# Altium schematic sheet WX0.007.102DL.SchDoc
size A3
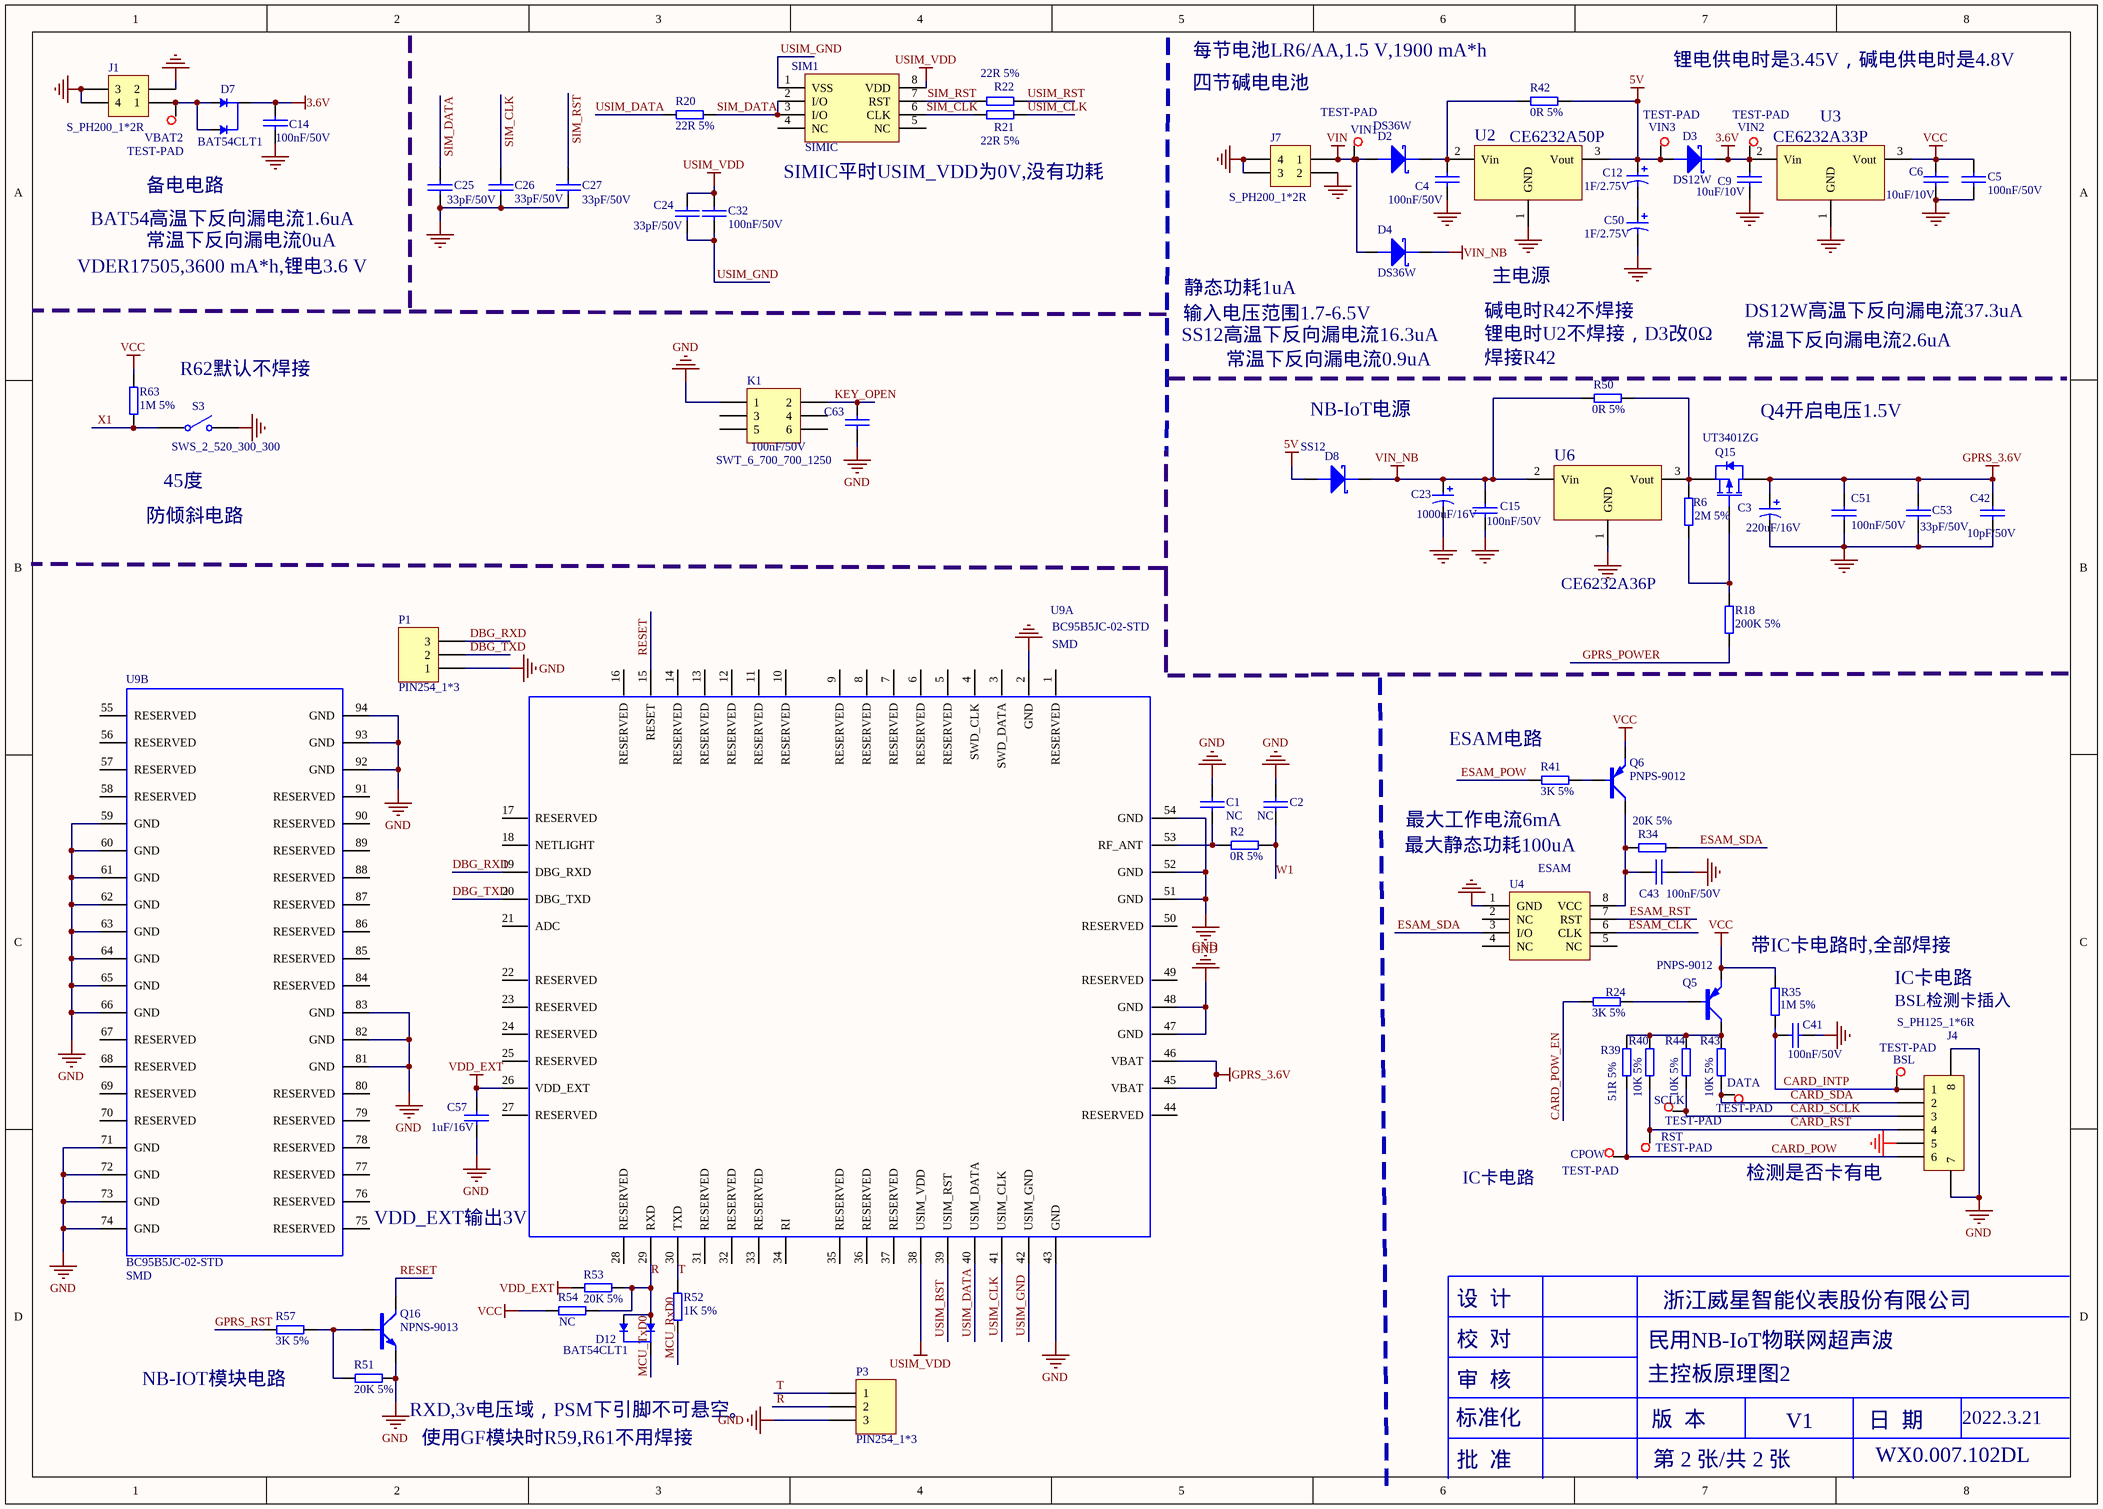
[diagram p0: WX0.007.102DL.SchDoc]

## Parts
BSL  TEST-PAD  [TEST-PAD]
C1  NC  [CAP0603]
C2  NC  [CAP0603]
C3  220uF/16V  [220uf]
C4  100nF/50V  [CAP0603]
C5  100nF/50V  [CAP0603]
C6  10uF/10V  [CAP0603]
C9  10uF/10V  [CAP0603]
C12  1F/2.75V  [CE-8*11.5]
C14  100nF/50V  [CAP0603]
C15  100nF/50V  [CAP0603]
C23  1000uF/16V  [CAPSM_450_1000_1050]
C24  33pF/50V  [CAP0603]
C25  33pF/50V  [CAP0603]
C26  33pF/50V  [CAP0603]
C27  33pF/50V  [CAP0603]
C32  100nF/50V  [CAP0603]
C41  100nF/50V  [CAP0603]
C42  10pF/50V  [CAP0603]
C43  100nF/50V  [CAP0603]
C50  1F/2.75V  [CE-8*11.5]
C51  100nF/50V  [CAP0603]
C53  33pF/50V  [CAP0603]
C57  1uF/16V  [CAP0603]
C63  100nF/50V  [CAP0603]
CPOW  TEST-PAD  [TEST-PAD]
D2  DS36W  [SOD-123FL]
D3  DS12W  [SOD-123FL]
D4  DS36W  [SOD-123FL]
D7  BAT54CLT1  [SOT-23]
D8  SS12  [DO-214AC]
D12  BAT54CLT1  [SOT-23]
DATA  TEST-PAD  [TEST-PAD]
J1  S_PH200_1*2R  [SMT2-2.0]
J4  S_PH125_1*6R  [SMT-1.25-6]
J7  S_PH200_1*2R  [SMT2-2.0]
K1  SWT_6_700_700_1250  [KFT DIP-5.8X5.8]
P1  PIN254_1*3  [PIN254_1*3*WXHJ]
P3  PIN254_1*3  [PIN254_1*3*WXHJ]
Q5  PNPS-9012  [SOT-23]
Q6  PNPS-9012  [SOT-23]
Q15  UT3401ZG  [SOT-23]
Q16  NPNS-9013  [SOT-23]
R2  0R 5%  [RES0603]
R6  2M 5%  [RES0603]
R18  200K 5%  [RES0603]
R20  22R 5%  [RES0603]
R21  22R 5%  [RES0603]
R22  22R 5%  [RES0603]
R24  3K 5%  [RES0603]
R34  20K 5%  [RES0603]
R35  1M 5%  [RES0603]
R39  51R 5%  [RES1206]
R40  10K 5%  [RES0603]
R41  3K 5%  [RES0603]
R42  0R 5%  [RES1206]
R43  10K 5%  [RES0603]
R44  10K 5%  [RES0603]
R50  0R 5%  [RES1206]
R51  20K 5%  [RES0603]
R52  1K 5%  [RES0603]
R53  20K 5%  [RES0603]
R54  NC  [RES0603]
R57  3K 5%  [RES0603]
R63  1M 5%  [RES0603]
RST  TEST-PAD  [TEST-PAD]
S3  SWS_2_520_300_300  [SWS_2_520_300]
SCLK  TEST-PAD  [TEST-PAD]
SIM1  SIMIC  [SIMIC]
U2  CE6232A50P  [SOT-89]
U3  CE6232A33P  [SOT-89]
U4  ESAM  [SOP-8]
U6  CE6232A36P  [SOT-89]
U9  BC95B5JC-02-STD  SMD/DIP: SMD  [BC95B5JC-02-STD]  (parts A,B of 2)
VBAT2  TEST-PAD  [TEST-PAD]
VIN1  TEST-PAD  [TEST-PAD]
VIN2  TEST-PAD  [TEST-PAD]
VIN3  TEST-PAD  [TEST-PAD]

## Nets
3.6V: C9.1 C14.1 D3.2 D7.3(C) U3.2(Vin) VIN2.1
5V: C12.1 D3.1 D8.1 R42.2 U2.3(Vout) VIN3.1
GND: C1.2 C2.2 C3.2 C4.2 C5.2 C6.2 C9.2 C14.2 C15.2 C23.2 C25.2 C26.2 C27.2 C41.2 C42.2 C43.2 C50.2 C51.2 C53.2 C57.2 C63.1 J1.2 J1.3 J1.4 J4.5 J4.7 J4.8 J7.2 J7.3 J7.4 K1.1 P1.1 P3.3 Q16.2(E) R51.2 S3.2 U2.1(GND) U3.1(GND) U4.1(GND) U6.1(GND) U9.2(GND) U9.43(GND) U9.47(GND) U9.48(GND) U9.51(GND) U9.52(GND) U9.54(GND) U9.59(GND) U9.60(GND) U9.61(GND) U9.62(GND) U9.63(GND) U9.64(GND) U9.65(GND) U9.66(GND) U9.71(GND) U9.72(GND) U9.73(GND) U9.74(GND) U9.81(GND) U9.82(GND) U9.83(GND) U9.92(GND) U9.93(GND) U9.94(GND)
GPRS_3.6V: C3.1 C42.1 C51.1 C53.1 Q15.3(D) U9.45(VBAT) U9.46(VBAT)
USIM_VDD: C24.1 C32.1 SIM1.8(VDD) U9.38(USIM_VDD)
VCC: C5.1 C6.1 Q5.2(E) Q6.2(E) R35.2 R54.1 R63.2 U3.3(Vout)
VDD_EXT: C57.1 R53.1 U9.26(VDD_EXT)
VIN: D2.1 D4.1 J7.1 VIN1.1
VIN_NB: C15.1 C23.1 D4.2 D8.2 R50.1 U6.2(Vin)
CARD_INTP: BSL.1 C41.1 J4.1 R35.1
CARD_POW: CPOW.1 J4.6 R39.1
CARD_POW_EN: R24.1
CARD_RST: J4.4 R40.1 RST.1
CARD_SCLK: J4.3 R44.1 SCLK.1
CARD_SDA: DATA.1 J4.2 R43.1
DBG_RXD: P1.3 U9.19(DBG_RXD)
DBG_TXD: P1.2 U9.20(DBG_TXD)
ESAM_CLK: U4.6(CLK)
ESAM_POW: R41.1
ESAM_RST: U4.7(RST)
ESAM_SDA: R34.2 U4.3(I/O)
GPRS_POWER: R18.1
GPRS_RST: R57.1
KEY_OPEN: C63.2 K1.2
MCU_RxD0: R52.1
MCU_TxD0: D12.3(C)
R: D12.1(A) D12.2(A) P3.2 R53.2 R54.2 U9.29(RXD)
RESET: Q16.3(C) U9.15(RESET)
SIM_CLK: C26.1 R21.1 SIM1.6(CLK)
SIM_DATA: C25.1 R20.2 SIM1.2(I/O) SIM1.3(I/O)
SIM_RST: C27.1 R22.1 SIM1.7(RST)
T: P3.1 R52.2 U9.30(TXD)
USIM_CLK: R21.2 U9.41(USIM_CLK)
USIM_DATA: R20.1 U9.40(USIM_DATA)
USIM_GND: C24.2 C32.2 SIM1.1(VSS) U9.42(USIM_GND)
USIM_RST: R22.2 U9.39(USIM_RST)
W1: C2.1 R2.1
X1: R63.1 S3.1
NetC1_1: C1.1 R2.2 U9.53(RF_ANT)
NetC4_1: C4.1 D2.2 R42.1 U2.2(Vin)
NetC12_2: C12.2 C50.1
NetC43_1: C43.1 Q6.3(C) R34.1 U4.8(VCC)
NetD7_1: D7.1(A) D7.2(A) J1.1 VBAT2.1
NetQ5_1: Q5.1(B) R24.2
NetQ5_3: Q5.3(C) R39.2 R40.2 R43.2 R44.2
NetQ6_1: Q6.1(B) R41.2
NetQ15_1: Q15.1(G) R6.1 R18.2
NetQ15_2: Q15.2(S) R6.2 R50.2 U6.3(Vout)
NetQ16_1: Q16.1(B) R51.1 R57.2

Not connected (* = marked no-connect by the designer): K1 3 4 5 6; SIM1 4(NC) 5(NC); U4 2(NC) 4(NC) 5(NC); U9 1(RESERVED) 3(SWD_DATA) 4(SWD_CLK) 5(RESERVED) 6(RESERVED) 7(RESERVED) 8(RESERVED) 9(RESERVED) 10(RESERVED) 11(RESERVED) 12(RESERVED) 13(RESERVED) 14(RESERVED) 16(RESERVED) 17(RESERVED) 18(NETLIGHT) 21(ADC) 22(RESERVED) 23(RESERVED) 24(RESERVED) 25(RESERVED) 27(RESERVED) 28(RESERVED) 31(RESERVED) 32(RESERVED) 33(RESERVED) 34(RI) 35(RESERVED) 36(RESERVED) 37(RESERVED) 44(RESERVED) 49(RESERVED) 50(RESERVED) 55(RESERVED) 56(RESERVED) 57(RESERVED) 58(RESERVED) 67(RESERVED) 68(RESERVED) 69(RESERVED) 70(RESERVED) 75(RESERVED) 76(RESERVED) 77(RESERVED) 78(RESERVED) 79(RESERVED) 80(RESERVED) 84(RESERVED) 85(RESERVED) 86(RESERVED) 87(RESERVED) 88(RESERVED) 89(RESERVED) 90(RESERVED) 91(RESERVED)

## Notes on the sheet
- 四节碱电电池
- 每节电池LR6/AA,1.5 V,1900 mA*h
- 锂电供电时是3.45V，碱电供电时是4.8V
- SIMIC平时USIM_VDD为0V,没有功耗
- BAT54高温下反向漏电流1.6uA
- 备电电路
- 常温下反向漏电流0uA
- VDER17505,3600 mA*h,锂电3.6 V
- 静态功耗1uA
- 碱电时R42不焊接
- 主电源
- DS12W高温下反向漏电流37.3uA
- R62默认不焊接
- SS12高温下反向漏电流16.3uA
- 输入电压范围1.7-6.5V
- 常温下反向漏电流0.9uA
- (near R50) 锂电时U2不焊接，D3改0Ω
- 焊接R42
- 常温下反向漏电流2.6uA
- NB-IoT电源
- Q4开启电压1.5V
- 45度
- 防倾斜电路
- (near R41) ESAM电路
- 最大静态功耗100uA
- 最大工作电流6mA
- 带IC卡电路时,全部焊接
- IC卡电路
- BSL检测卡插入
- 检测是否卡有电
- (near U9) VDD_EXT输出3V
- 设  计
- 浙江威星智能仪表股份有限公司
- NB-IOT模块电路
- 审  核
- 校  对
- 民用NB-IoT物联网超声波
- 主控板原理图2
- RXD,3v电压域，PSM下引脚不可悬空。
- 使用GF模块时R59,R61不用焊接
- 标准化
- 版  本
- V1
- 日  期
- WX0.007.102DL
- 2022.3.21
- 批  准
- 第 2 张/共 2 张

## Library data of the parts
BSL CPOW DATA RST SCLK VBAT2 VIN1-VIN3 = AD_WXHJ_TEST-PAD_01: 单面焊盘测试点; Part Name: 测试点; ID: 23; SMD/DIP: SMD; Part Number: AD_WXHJ_TEST-PAD_01
C1 C2 = 101020103-0005: Part Name: 0603贴片电容; ID: 11; SMD/DIP: SMD
C3 = 1010203-0029: 220UF; Part Number: 1010203-0026; Part Name: 电解电容; ID: 2; SMD/DIP: DIP
C4 C5 C14 C15 C32 C41 C43 C51 C63 = 101020103-0021: 104pF,50 V,±10%,0603,国巨,CC0603KRX7R9BB104; Part Name: 0603贴片电容; ID: 3; SMD/DIP: SMD; Part Number: 101020103-0021
C6 C9 = 101020103-0026: 106pF,10 V,±10%,0603,村田,GRM188R61A106KE47D; Part Name: 0603贴片电容; ID: 8; SMD/DIP: SMD; Part Number: 101020103-0026
C12 C50 = 1010202-0015: 1F,2.75 V,-20%~+20%,8mm*16mm,红宝石,2.7 DMC 1 M MY4 8X16; Part Name: 法拉电容; ID: 12; SMD/DIP: DIP; Part Number: 1010202-0015
C23 = 1010203-0029: 1000UF,16V,±20%,贴片10*10.2MM,深圳市三炎科电子科技有限公司,16V1000UF; Part Number: 1010203-0026; Part Name: 电解电容; ID: 2; SMD/DIP: DIP
C24-C27 C53 = 101020103-0027: 33pF,50 V,±10%,0603,国巨,CC0603KRNPO9BN33; Part Name: 0603贴片电容; ID: 18; SMD/DIP: SMD; Part Number: 101020103-0027
C42 = 101020103-0014: 10pF,50 V,±5%,0603,X7R,国巨,CC0603JRNPO9BN100; Part Name: 0603贴片电容; ID: 7; SMD/DIP: SMD; Part Number: 101020103-0014
C57 = 101020103-0003: 105pF,16 V,±10%,0603,国巨,CC0603KRX7R7BB105; Part Name: 0603贴片电容; ID: 14; SMD/DIP: SMD; Part Number: 101020103-0003
D2 = 101040101-0048: DS36W,SOD123-FL,3 A,42 V,60 V,浙江领晨科技有限公司,DS36W; Part Number: 101040101-0055; Part Name: 贴片肖特基; ID: 8; SMD/DIP: SMD
D3 = 101040101-0048: DS12W,SOD-123FL,1 A,0.55 V,20 V,领晨科技,DS12W; Part Name: 贴片肖特基; ID: 9; SMD/DIP: SMD; Part Number: 101040101-0048
D4 = 101040101-0055: DS36W,SOD123-FL,3 A,42 V,60 V,浙江领晨科技有限公司,DS36W; Part Name: 贴片肖特基; ID: 40; SMD/DIP: SMD; Part Number: 101040101-0055
D7 = 101040101-0038: BAT54CLT1，SOT23-3,SOT23-3,0.2 A,0.8 V,30 V,安森美,BAT54CLT1; Part Name: 贴片肖特基; ID: 31; SMD/DIP: SMD; Part Number: 101040101-0038
D8 = 101040101-0009: SS12,DO-214AC,1 A,0.55 V,20 V,昶鑫,SS12; Part Name: 贴片肖特基; ID: 13; SMD/DIP: SMD; Part Number: 101040101-0009
D12 = 101040101-0038: BAT54CLT1，SOT23-3,SOT23-3,0.2 A,0.8 V,30 V,安森美,BAT54CLT1; Part Name: 贴片肖特基; ID: 8; SMD/DIP: SMD; Part Number: 101040101-0038
J1 J7 = 1010902-0125: PH2.0_2AWR 卧,贴片卧式,母头,单排,2针2.0mm; Part Name: PH座; ID: 24; SMD/DIP: SMD; Part Number: 1010902-0125
J4 = 1010902-0121: 1.25-6AWR 卷,6针1.25mm,母头,单排,贴片卧式; Part Name: PH座; ID: 23; SMD/DIP: SMD; Part Number: 1010902-0121
K1 = 1011001-0037: 7*7无锁按键,点触,7*7*12.5mm,7*7无锁按键,正立; Part Name: 按键; ID: 39; SMD/DIP: DIP; Part Number: 1011001-0037
Q5 Q6 = 101040201-0001: 9012,PNP,SOT-23,JCET;长电,S9012; Part Name: 贴片三极管; ID: 16; SMD/DIP: SMD; Part Number: 101040201-0001
Q15 = 101040201-0013: UT3401ZG,P-MOS,SOT-23,UTC,UT3401ZG; Part Name: 功率MOS管; ID: 18; SMD/DIP: SMD; Part Number: 101040201-0013
Q16 = 101040201-0002: 9013,NPN,SOT-23,长电,S9013; Part Name: 贴片三极管; ID: 15; SMD/DIP: SMD; Part Number: 101040201-0002
R2 = 101010103-0001: 国巨,±5%,0603,,155 ℃,-55 ℃,RC0603J2-070RL,无铅,200 ppm/℃,1/10W,,0R; Part Name: 0603贴片电阻; ID: 1; SMD/DIP: SMD; Part Number: 101010103-0001
R6 = 101010103-0025: 国巨,±5%,0603,,155 ℃,-55 ℃,RC0603JR-072ML,含铅,100 ppm/℃,1/10W,,2M; Part Name: 0603贴片电阻; ID: 20; SMD/DIP: SMD; Part Number: 101010103-0025
R18 = 101010103-0034: 200K,±5%,1/10W,0603,国巨,RC0603JR-07200KL; Part Name: 0603贴片电阻; ID: 13; SMD/DIP: SMD; Part Number: 101010103-0034
R20-R22 = 101010103-0009: 国巨,±5%,0603,,155 ℃,-55 ℃,RC0603JR-0722RL,无铅,200 ppm/℃,1/10W,,22欧; Part Name: 0603贴片电阻; ID: 17; SMD/DIP: SMD; Part Number: 101010103-0009
R24 = 101010103-0006: 国巨,±5%,0603,,155 ℃,-55 ℃,RC0603JR-073KL,无铅,100 ppm/℃,1/10W,,3K; Part Name: 0603贴片电阻; ID: 22; SMD/DIP: SMD; Part Number: 101010103-0006
R34 R51 R53 R54 = 101010103-0004: 国巨,±5%,0603,,155 ℃,-55 ℃,RC0603JR-0720KL,无铅,200 ppm/℃,1/10W,,20K; Part Name: 0603贴片电阻; ID: 15; SMD/DIP: SMD; Part Number: 101010103-0004
R35 = 101010103-0002: 国巨,±5%,0603,,155 ℃,-55 ℃,RC0603JR-071ML,无铅,200 ppm/℃,1/10W,,1M; Part Name: 0603贴片电阻; ID: 10; SMD/DIP: SMD; Part Number: 101010103-0002
R39 = 101010101-0029: 51Ω,±5%,1/4W,1206,国巨,RC1206JR-0751RL; Part Name: 1206贴片电阻; ID: 28; SMD/DIP: SMD; Part Number: 101010101-0029
R40 R41 R43 R44 = 101010103-0003: 国巨,±5%,0603,,155 ℃,-55 ℃,RC0603JR-0710KL,无铅,200 ppm/℃,1/10W,,10K; Part Name: 0603贴片电阻; ID: 7; SMD/DIP: SMD; Part Number: 101010103-0003
R42 R50 = 101010101-0013: 0Ω,±5%,1/4W,1206,国巨,RC1206JR-070RL; Part Name: 1206贴片电阻; ID: 2; SMD/DIP: SMD; Part Number: 101010101-0013
R52 = 101010103-0008: 1K,±5%,1/10W,0603,国巨,RC0603JR-071KL; Part Name: 0603贴片电阻; ID: 10; SMD/DIP: SMD; Part Number: 101010103-0008
R57 = 101010103-0006: 国巨,±5%,0603,,155 ℃,-55 ℃,RC0603JR-073KL,无铅,100 ppm/℃,1/10W,,3K; Part Name: 0603贴片电阻; ID: 23; SMD/DIP: SMD; Part Number: 101010103-0006
R63 = 101010103-0002: 国巨,±5%,0603,,155 ℃,-55 ℃,RC0603JR-071ML,无铅,200 ppm/℃,1/10W,,1M; Part Name: 0603贴片电阻; ID: 11; SMD/DIP: SMD; Part Number: 101010103-0002
S3 = 1011001-0041: CSX-SEN-645B,垂直45°开关转换,3*5.2mm,360°任意方位倾斜检测,深圳市成晟科技有限公司; Part Number: 1011001-0051; Part Name: 倾斜开关; ID: 33; SMD/DIP: SMD
SIM1 = AD_XN_SIMIC_01: SIMIC虚拟器件; ID: 20; SMD/DIP: SMD; Part Number: AD_XN_SIMIC_01; Part Name: SIMIC
U2 = 1010503-0013: S-1206B50-U3,S-1206B50-U3,SOT89-3,6.5 V,1.7 V,0.2 V,5 V,250mA@VIN≧VOUT(S)＋1.0 V﹐1.5 V≦VOUT(S),1 uA,精工电子; Part Name: 贴片稳压器; ID: 6; SMD/DIP: SMD; Part Number: 1010503-0013
U3 = 1010503-0002: S-1206B33-U3T1G,S-1206B33-U3T1G,SOT89-3,6.5 V,1.7 V,0.15 V,3.3 V,250mA@VIN≧VOUT(S)＋1.0 V﹐1.5 V≦VOUT(S),1 uA,精工电子; Part Name: 线性稳压芯片; ID: 5; SMD/DIP: SMD; Part Number: 1010503-0002
U4 = AD_XN_ESAM_01: ESAM虚拟器件; Part Name: ESAM芯片; ID: 11; SMD/DIP: SMD; Part Number: AD_XN_ESAM_01
U6 = 1010503-0031: CE6232A36P,CE6232A36P,SOT89-3,8 V,1.8 V,0.11 V,3.6 V,600mA,0.8 uA,南京芯力微电子有限公司; Part Name: 贴片稳压器; ID: 30; SMD/DIP: SMD; Part Number: 1010503-0031
U9 = 1011402-0141: BC95-B5,23.6mm*19.9mm*2.2mm,BC95B5JC-02-STD,LCC贴片封装,上海移远通信技术股份; Part Name: NB-IOT模块; ID: 15; Value: *; Part Description: *; PCB DECAL: *; Part Number: 1011402-0141